# EAGLE design PSU 2x+ (EAGLE 6.3)
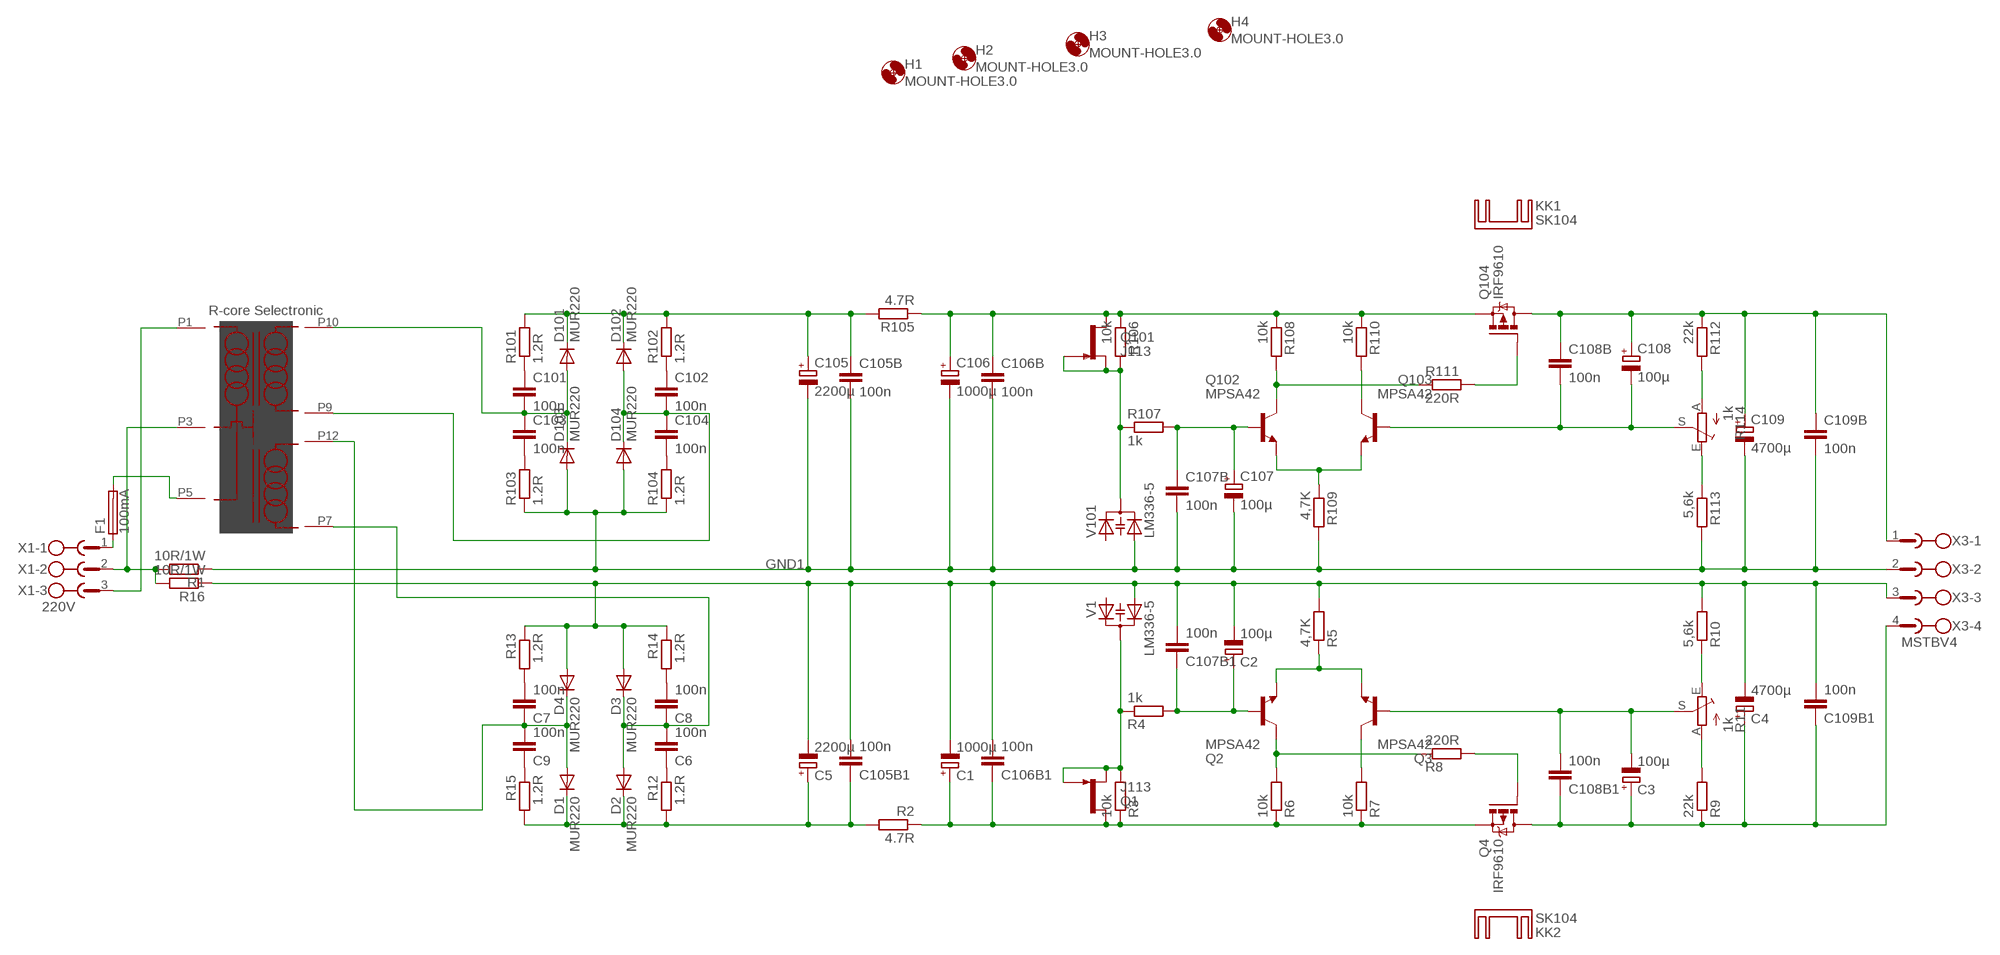
[diagram p0: schematic, sheet 1]

## Parts
C1  1000µ  CPOL-EUE7.5-16  [E7,5-16]
C2  100µ  CPOL-EUE5-10.5  [E5-10,5]
C3  100µ  CPOL-EUE5-10.5  [E5-10,5]
C4  4700µ  CPOL-EUE10-25  [EB25D]
C5  2200µ  CPOL-EUE7.5-16  [E7,5-16]
C6  100n  C-EU050-025X075  [C050-025X075]
C7  100n  C-EU050-025X075  [C050-025X075]
C8  100n  C-EU050-025X075  [C050-025X075]
C9  100n  C-EU050-025X075  [C050-025X075]
C101  100n  C-EU050-025X075  [C050-025X075]
C102  100n  C-EU050-025X075  [C050-025X075]
C103  100n  C-EU050-025X075  [C050-025X075]
C104  100n  C-EU050-025X075  [C050-025X075]
C105  2200µ  CPOL-EUE7.5-16  [E7,5-16]
C105B  100n  C-EU050-025X075  [C050-025X075]
C105B1  100n  C-EU050-025X075  [C050-025X075]
C106  1000µ  CPOL-EUE7.5-16  [E7,5-16]
C106B  100n  C-EU050-025X075  [C050-025X075]
C106B1  100n  C-EU050-025X075  [C050-025X075]
C107  100µ  CPOL-EUE5-10.5  [E5-10,5]
C107B  100n  C-EU050-025X075  [C050-025X075]
C107B1  100n  C-EU050-025X075  [C050-025X075]
C108  100µ  CPOL-EUE5-10.5  [E5-10,5]
C108B  100n  C-EU050-025X075  [C050-025X075]
C108B1  100n  C-EU050-025X075  [C050-025X075]
C109  4700µ  CPOL-EUE10-25  [EB25D]
C109B  100n  C-EU050-025X075  [C050-025X075]
C109B1  100n  C-EU050-025X075  [C050-025X075]
D1  MUR220  BY500  [DO201-15]
D2  MUR220  BY500  [DO201-15]
D3  MUR220  BY500  [DO201-15]
D4  MUR220  BY500  [DO201-15]
D101  MUR220  BY500  [DO201-15]
D102  MUR220  BY500  [DO201-15]
D103  MUR220  BY500  [DO201-15]
D104  MUR220  BY500  [DO201-15]
F1  100mA  GSH15  [GSH15]
H1  MOUNT-HOLE3.0  [3,0]
H2  MOUNT-HOLE3.0  [3,0]
H3  MOUNT-HOLE3.0  [3,0]
H4  MOUNT-HOLE3.0  [3,0]
KK1  SK104  [SK104]
KK2  SK104  [SK104]
Q1  J113  2N5458  [TO-92]
Q2  MPSA42  -NPN-TO92-EBC  [TO92-EBC]
Q3  MPSA42  -NPN-TO92-EBC  [TO92-EBC]
Q4  IRF9610  IRF9530  [TO220BV]
Q101  J113  2N5458  [TO-92]
Q102  MPSA42  -NPN-TO92-EBC  [TO92-EBC]
Q103  MPSA42  -NPN-TO92-EBC  [TO92-EBC]
Q104  IRF9610  IRF9530  [TO220BV]
R1  10R/1W  R-EU_0309/12  [0309/12]
R2  4.7R  R-EU_0207/10  [0207/10]
R3  10k  R-EU_0207/10  [0207/10]
R4  1k  R-EU_0207/10  [0207/10]
R5  4,7K  R-EU_0207/10  [0207/10]
R6  10k  R-EU_0207/10  [0207/10]
R7  10k  R-EU_0207/10  [0207/10]
R8  220R  R-EU_0207/10  [0207/10]
R9  22k  R-EU_0207/10  [0207/10]
R10  5,6k  R-EU_0207/10  [0207/10]
R11  1k  TRIM_EU-S64W  [S64W]
R12  1.2R  R-EU_0207/10  [0207/10]
R13  1.2R  R-EU_0207/10  [0207/10]
R14  1.2R  R-EU_0207/10  [0207/10]
R15  1.2R  R-EU_0207/10  [0207/10]
R16  10R/1W  R-EU_0309/12  [0309/12]
R101  1.2R  R-EU_0207/10  [0207/10]
R102  1.2R  R-EU_0207/10  [0207/10]
R103  1.2R  R-EU_0207/10  [0207/10]
R104  1.2R  R-EU_0207/10  [0207/10]
R105  4.7R  R-EU_0207/10  [0207/10]
R106  10k  R-EU_0207/10  [0207/10]
R107  1k  R-EU_0207/10  [0207/10]
R108  10k  R-EU_0207/10  [0207/10]
R109  4,7K  R-EU_0207/10  [0207/10]
R110  10k  R-EU_0207/10  [0207/10]
R111  220R  R-EU_0207/10  [0207/10]
R112  22k  R-EU_0207/10  [0207/10]
R113  5,6k  R-EU_0207/10  [0207/10]
R114  1k  TRIM_EU-S64W  [S64W]
U$1  R-CORE-SELECTRONIC-PCB  [R-CORE48MM]
V1  LM336-5  DIODE-2CAPACITANCESOT54E  [SOT54E]
V101  LM336-5  DIODE-2CAPACITANCESOT54E  [SOT54E]
X1  220V  MSTBV3  [MSTBV3]
X3  MSTBV4  [MSTBV4]

## Nets
EARTH [power]: R1.2 R16.2 U$1.P3(SHIELD3) X1.2
GND1 [power]: C105.- C105B.2 C106.- C106B.2 C107.- C107B.2 C109.- C109B.2 D103.A D104.A R1.1 R103.1 R104.1 R109.2 R113.2 V101.A2 X3.2
GND2 [power]: C1.- C2.- C4.- C5.- C105B1.2 C106B1.2 C107B1.2 C109B1.2 D3.A D4.A R5.2 R10.2 R13.1 R14.1 R16.1 V1.A2 X3.3
N$1 [power]: C101.2 C103.1 D101.A D103.C U$1.P10(SEC2-10)
N$2 [power]: C102.2 C104.1 D102.A D104.C U$1.P9(SEC2-9)
N$3: C102.1 R102.1
N$4: C103.2 R103.2
N$5 [power]: C106.+ C106B.1 Q101.1(D) Q104.S R105.1 R106.1 R108.1 R110.1
N$6: C101.1 R101.1
N$7: C104.2 R104.2
N$8 [power]: C105.+ C105B.1 D101.C D102.C R101.2 R102.2 R105.2
N$10 [power]: C6.2 C8.1 D2.A D3.C U$1.P7(SEC1-7)
N$11 [power]: C7.1 C9.2 D1.A D4.C U$1.P12(SEC1-12)
N$13 [power]: C5.+ C105B1.1 D1.C D2.C R2.2 R12.2 R15.2
N$14 [power]: C1.+ C106B1.1 Q1.1(D) Q4.S R2.1 R3.1 R6.1 R7.1
N$15: C2.+ C107B1.1 Q2.B R4.2
N$16 [power]: C3.+ C4.+ C108B1.1 C109B1.1 Q4.D R9.1 X3.4
N$18 [Mains]: F1.1 X1.1
N$19: Q2.C R6.2 R8.1
N$20: Q104.G R111.2
N$21: Q102.C R108.2 R111.1
N$22: Q3.C R7.2
N$23: C107.+ C107B.1 Q102.B R107.2
N$24: Q2.E Q3.E R5.1
N$25: Q103.C R110.2
N$26: Q102.E Q103.E R109.1
N$27: Q1.2(S) Q1.3(G) R3.2 R4.1 V1.C
N$28: Q4.G R8.2
N$29 [power]: C108.+ C108B.1 C109.+ C109B.1 Q104.D R112.1 X3.1
N$30: Q101.2(S) Q101.3(G) R106.2 R107.1 V101.C
N$31: C3.- C108B1.2 Q3.B R11.S
N$32: C108.- C108B.2 Q103.B R114.S
N$33: R9.2 R11.A
N$34: R112.2 R114.A
N$35: R113.1 R114.E
N$36: R10.1 R11.E
N$37: C6.1 R12.1
N$38 [Mains]: F1.2 U$1.P5(PRIM5)
N$39: C7.2 R13.2
N$40 [Mains]: U$1.P1(PRIM-1) X1.3
N$42: C8.2 R14.2
N$43: C9.1 R15.1
Unconnected: V1.A1 V101.A1

## Library data of the parts
C1-C5 C105-C109 = rcl:CPOL-EU: POLARIZED CAPACITOR, European symbol
C6-C9 C101-C104 C105B C105B1 C106B C106B1 C107B C107B1 C108B C108B1 C109B C109B1 = rcl:C-EU: CAPACITOR, European symbol
D1-D4 D101-D104 = diode:BY500: DIODE fast recovery diode, 5 A, 800 V
F1 = fuse:GSH15: FUSE HOLDER grid 15mm, 19649 Wickmann; MPN: 64900001039; OC_FARNELL: 1271673; OC_NEWARK: 02P0318
H1-H4 = holes:MOUNT-HOLE: MOUNTING HOLE with drill center marker
KK1 KK2 = heatsink:SK104: HEATSINK manufacturer Fischer/distributor Buerklin
Q1 Q101 = 00_steve:2N5458
Q2 Q3 Q102 Q103 = transistor:*-NPN-: NPN Transistror BF959 corrected 2008.03.06
Q4 Q104 = transistor-power:IRF9530: P-CHANNEL HEXFET POWER-MOS-FET Source: http://www.irf.com/product-info/datasheets/data/irf9530.pdf
R1-R10 R12-R16 R101-R113 = rcl:R-EU_: RESISTOR, European symbol
R11 R114 = pot:TRIM_EU-: POTENTIOMETER
U$1 = gael:R-CORE-SELECTRONIC-PCB: Transformateurs R-core pour PCB vendus par Selectronic (GAJ)
V1 V101 = diode:DIODE-2CAPACITANCE: Capacity DIODE variable-capacitance diode (Infineon)
X1 = con-phoenix-508:MSTBV3: PHOENIX; MPN: MSTBV 2,5/3-GF-5.08; OC_FARNELL: 1792793; OC_NEWARK: 69R9846
X3 = con-phoenix-508:MSTBV4: PHOENIX; MPN: MSTBV 2,5/4-GF-5.08; OC_FARNELL: 1792794; OC_NEWARK: 69R9847

## Net classes
0 default: width 0.508 mm, clearance 0.203 mm
1 Mains: width 1.016 mm, clearance 2.5 mm
2 power: width 1.016 mm, clearance 0.203 mm

## Board
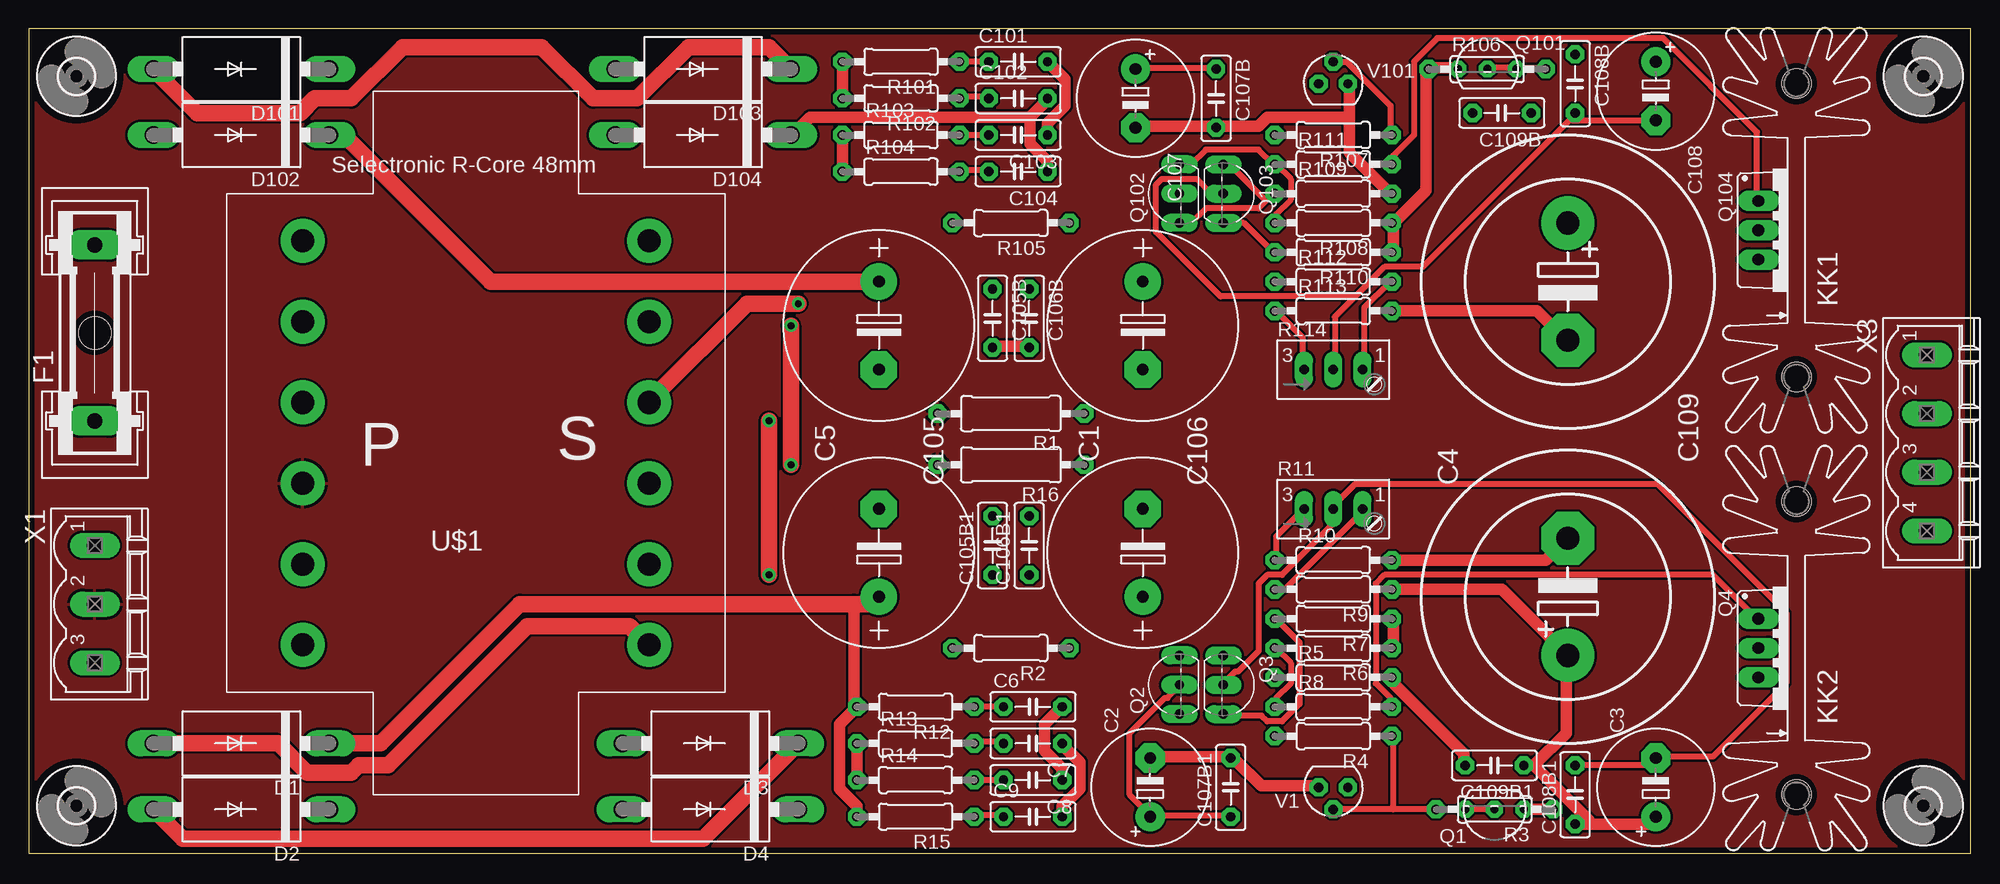
[diagram p1: board, top side]
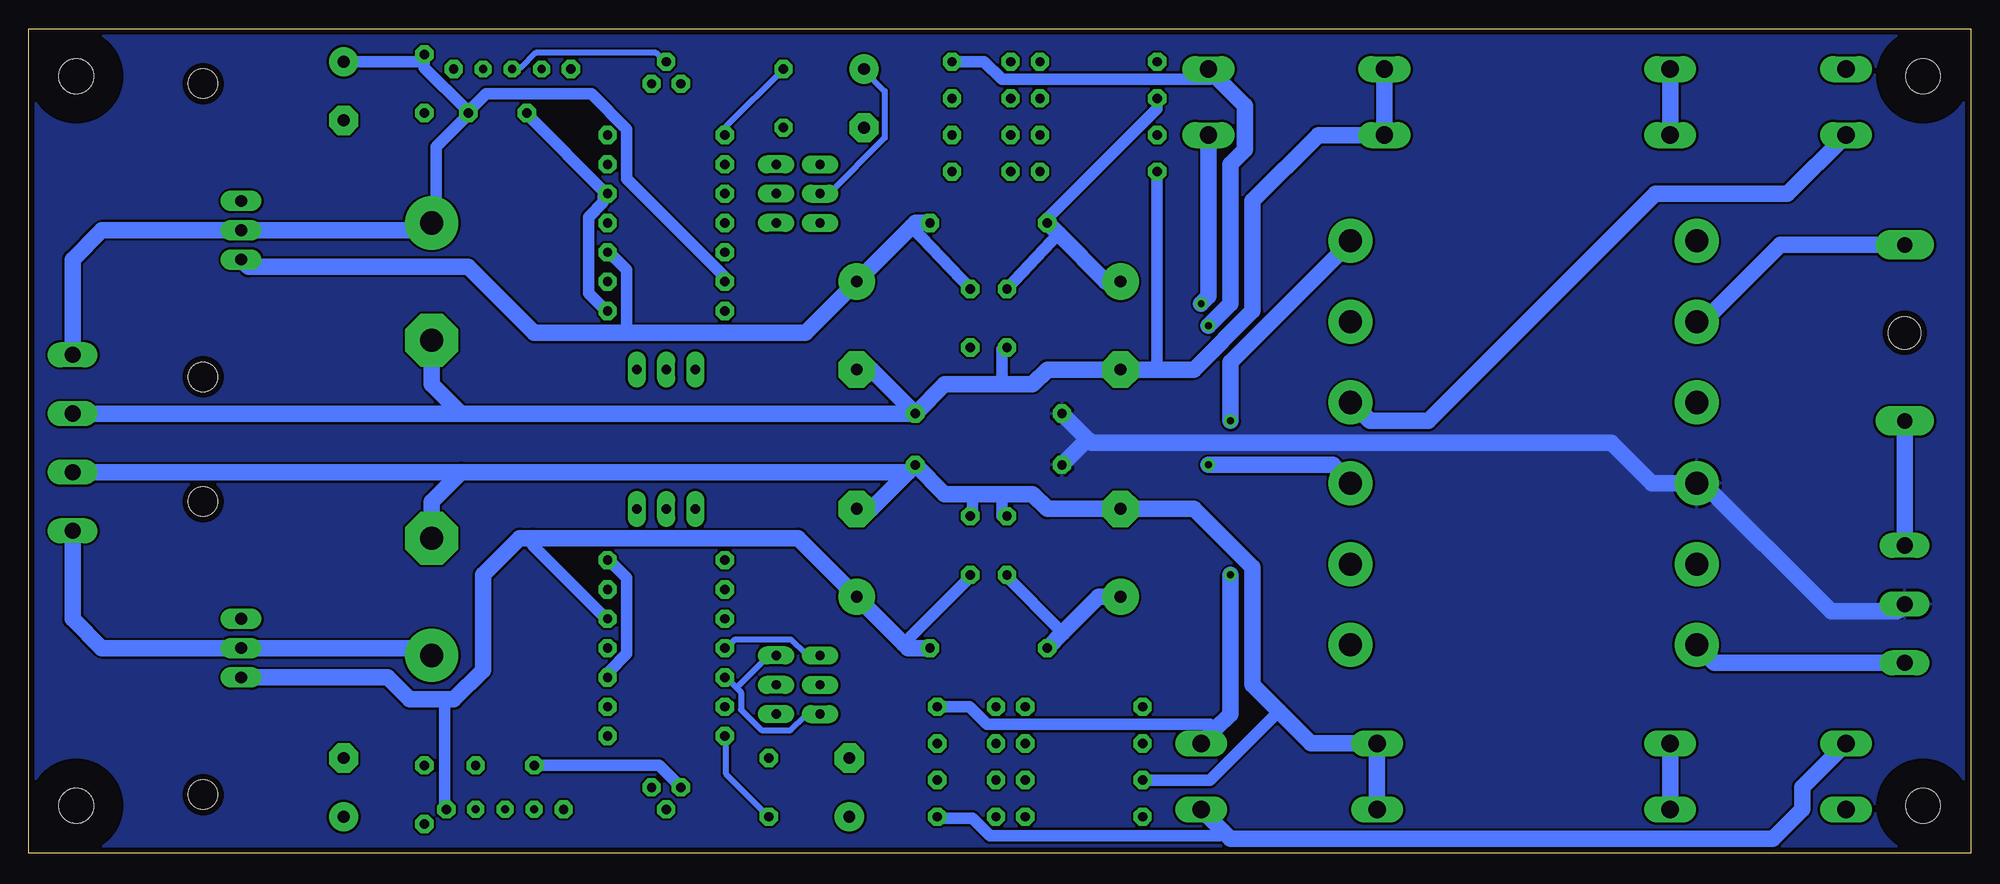
[diagram p2: board, bottom side, seen from below]

Size 168.25 x 71.42 mm. Coordinates in mm from the lower left corner, seen from the top.
Outline: 0,0 168.25,0 168.25,71.42 0,71.42 0,0
Copper layers (1*16): Top 0.035mm / dielectric 1.5mm / Bottom 0.035mm
Design rules "gael design rules": minimum track width 0.2mm, minimum drill 0.4mm, track to track 8mil, track to pad 8mil, pad to pad 8mil, via to via 8mil, smd to smd 8mil, copper to edge 20mil, drill to drill 8mil, minimum pad ring 15mil, minimum via ring 10mil, stop-mask expansion 4mil, vias tented up to drill 0mil, thermal gap 10mil

### Footprints (pad centres in the part's own frame; a part is rotated, then mirrored left to right if it is on the bottom)
E7,5-16 = drill 1.016 pad 3.15: + -3.81,0 | drill 1.016 pad 3.15 octagon: - 3.81,0
E5-10,5 = drill 1.016 pad 2.54: + -2.54,0 | drill 1.016 pad 2.54 octagon: - 2.54,0
EB25D = drill 2.007 pad 4.597: + -5.08,0 | drill 2.007 pad 4.597 octagon: - 5.08,0
C050-025X075 = drill 0.813 octagon: 1 -2.54,0; 2 2.54,0
DO201-15 = drill 1.499 long: A 7.62,0; C -7.62,0
GSH15 = drill 1.321 pad 2.54 long: 1 -7.62,0; 2 7.62,0 | hole 2.794: 0,0
3,0 = hole 3: 0,0
SK104 = hole 2.54: -12.7,-0.762; 12.7,-0.762
TO-92 = drill 0.7 octagon: 1 -2.54,0; 2 0,0; 3 2.54,0
TO92-EBC = drill 0.813 long: B 0,-1.27; C 2.54,-1.27; E -2.54,-1.27
TO220BV = drill 1.016 long: D 0,-2.54; G -2.54,-2.54; S 2.54,-2.54
0309/12 = drill 0.813 octagon: 1 -6.35,0; 2 6.35,0
0207/10 = drill 0.813 octagon: 1 -5.08,0; 2 5.08,0
S64W = drill 0.813 long: A 2.54,1.27; E -2.54,1.27; S 0,1.27
R-CORE48MM = drill 2 pad 3.81: P1 -15,-17.5; P2 -15,-10.5; P3 -15,-3.5; P4 -15,3.5; P5 -15,10.5; P6 -15,17.5; P7 15,17.5; P8 15,10.5; P9 15,3.5; P10 15,-3.5; P11 15,-10.5; P12 15,-17.5
SOT54E = drill 0.813 octagon: A1 -1.27,0; A2 1.27,0; C 0,1.905
MSTBV3 = drill 1.397 long: 1 -5.08,0; 2 0,0; 3 5.08,0
MSTBV4 = drill 1.397 long: 1 -7.62,0; 2 -2.54,0; 3 2.54,0; 4 7.62,0

### Placement (x,y rotation side)
C1  96.52,26.04 90 top
C2  97.16,5.71 90 top
C3  140.97,5.71 90 top
C4  133.35,22.23 90 top
C5  73.66,26.04 90 top
C6  86.99,12.7 0 top
C7  86.99,9.53 180 top
C8  86.99,6.35 180 top
C9  86.99,3.17 0 top
C101  85.72,68.58 0 top
C102  85.72,65.41 0 top
C103  85.72,62.23 180 top
C104  85.72,59.05 180 top
C105  73.66,45.72 270 top
C105B  83.5,46.35 270 top
C105B1  83.5,26.67 90 top
C106  96.52,45.72 270 top
C106B  86.68,46.35 270 top
C106B1  86.68,26.67 90 top
C107  95.88,65.41 270 top
C107B  102.87,65.41 270 top
C107B1  104.14,5.71 90 top
C108  140.97,66.04 270 top
C108B  133.99,66.67 270 top
C108B1  133.99,5.08 90 top
C109  133.35,49.53 270 top
C109B  127.63,64.14 180 top
C109B1  127,7.62 180 top
D1  18.41,9.53 180 top
D2  18.41,3.81 180 top
D3  59.05,9.53 180 top
D4  59.05,3.81 180 top
D101  18.41,67.94 180 top
D102  18.41,62.23 180 top
D103  58.42,67.94 180 top
D104  58.42,62.23 180 top
F1  5.72,45.09 90 top
H1  4.13,67.31 0 top
H2  4.13,4.13 0 top
H3  164.15,67.31 0 top
H4  164.15,4.13 0 top
KK1  152.4,53.98 90 top
KK2  152.4,17.78 90 top
Q1  127,3.81 180 top
Q2  98.42,14.61 90 top
Q3  104.77,14.61 270 top
Q4  152.4,17.78 270 top
Q101  126.36,67.94 0 top
Q102  98.42,57.15 90 top
Q103  104.77,57.15 270 top
Q104  152.4,53.98 270 top
R1  85.09,38.1 180 top
R2  85.09,17.78 180 top
R3  127,3.81 180 top
R4  113.03,10.16 180 top
R5  113.03,15.24 0 top
R6  113.03,17.78 180 top
R7  113.03,20.32 180 top
R8  113.03,12.7 0 top
R9  113.03,22.86 180 top
R10  113.03,25.4 0 top
R11  113.03,28.57 0 top
R12  76.83,12.7 180 top
R13  76.83,9.53 0 top
R14  76.83,6.35 0 top
R15  76.83,3.17 180 top
R16  85.09,33.66 180 top
R101  75.56,68.58 180 top
R102  75.56,65.41 180 top
R103  75.56,62.23 0 top
R104  75.56,59.05 0 top
R105  85.09,54.61 180 top
R106  126.36,67.94 0 top
R107  113.03,62.23 180 top
R108  113.03,54.61 180 top
R109  113.03,57.15 0 top
R110  113.03,52.07 180 top
R111  113.03,59.69 0 top
R112  113.03,49.53 0 top
R113  113.03,46.99 0 top
R114  113.03,40.64 0 top
U$1  38.73,35.56 0 top
V1  113.03,5.71 180 top
V101  113.03,66.67 0 top
X1  5.72,21.59 270 top
X3  164.47,35.56 270 top

### Tracks (layer width: path | path; a pad name or v marks a point on that pad's centre or on a via)
EARTH
  Bottom 1.422: X1.2 6.35,20.95 12.07,20.95 23.5,32.38 U$1.P3 27.62,32.06 31.12,35.56 76.2,35.56 76.52,35.88 | 76.52,35.88 R1.2 | R16.2 76.52,35.88
  pour Top: 0,71.44 168.28,71.44 168.28,0 0,0
  pour Bottom: 0,71.44 168.28,71.44 168.28,0 0,0
GND1
  Top 1.016: C107.- 95.88,62.99 102.74,62.99 C107B.2 103.25,62.99 106.55,62.99 107.31,63.75 114.43,63.75 | 114.43,63.75 114.43,60.71 117.98,57.15 R109.2 | 114.43,63.75 114.43,66.55 V101.A2 | R103.1 R104.1 | C105B.2 83.95,43.94 86.23,43.94 C106B.2 | R113.2 130.68,46.99 133.22,44.45 C109.-
  Bottom 1.016: C109B.2 125.09,64.01 118.24,57.15 R109.2 118.49,56.9 118.49,56.39 119.76,55.12 119.76,48.51 118.24,46.99 R113.2 | 83.95,40.64 83.95,43.69 C105B.2 | 70.48,41.91 R104.1
  Bottom 1.422: D103.A D104.A 56.52,62.23 62.23,56.52 62.23,46.99 67.31,41.91 70.48,41.91 C105.- 80.01,41.91 81.28,40.64 83.95,40.64 88.9,40.64 R1.1 | X3.2 130.81,38.1 | 130.81,38.1 R1.1 | C106.- 95.25,41.91 R1.1 | C109.- 133.35,40.64 130.81,38.1
GND2
  Top 1.016: R5.2 118.24,15.24 118.24,14.73 124.33,8.64 124.33,7.62 C109B1.2 | C2.- 97.16,8.38 104.01,8.38 C107B1.2 104.52,8.13 106.81,5.84 111.63,5.84 V1.A2 | R13.1 R14.1 | R10.2 131.44,25.4 C4.-
  Bottom 1.016: C109B1.2 113.66,7.62 V1.A2 | 83.95,31.11 83.95,29.21 C105B1.2 | 86.49,31.11 86.49,29.21 C106B1.2 | R14.1 65.91,6.35 59.94,12.32 | R5.2 117.98,15.24 117.98,15.75 116.46,17.27 116.46,23.88 117.98,25.4 R10.2
  Bottom 1.422: D4.A D3.A 57.15,9.53 59.94,12.32 62.23,14.61 62.23,24.77 67.31,29.84 C5.- 80.01,29.84 81.28,31.11 83.95,31.11 86.49,31.11 88.9,31.11 R16.1 | X3.3 130.81,33.02 | 130.81,33.02 92.07,33.02 R16.1 | C1.- 95.25,29.84 R16.1 | C4.- 133.35,30.48 130.81,33.02
N$1  (via drill 0.6)
  Top 1.016: C103.1 88.27,63.25 89.79,64.77 89.79,67.06 C101.2
  Top 1.422: D101.A 14.61,64.14 23.5,64.14 24.77,65.41 27.94,65.41 32.38,69.85 44.45,69.85 48.9,65.41 52.71,65.41 57.15,69.85 64.14,69.85 D103.C | v66.04,45.72 v66.04,33.66
  Bottom 1.016: C101.2 85.47,68.58 83.95,67.06 65.91,67.06 D103.C
  Bottom 1.422: v66.04,33.66 55.25,33.66 53.98,32.38 U$1.P10 | v66.04,45.72 64.14,47.62 64.14,59.69 62.87,60.96 62.87,64.77 D103.C
N$2  (via drill 0.6)
  Top 1.016: C104.1 88.27,59.94 86.74,61.47 86.74,63.75 | 86.74,63.75 88.27,65.28 C102.2 | 86.74,63.75 67.69,63.75 66.17,62.23 D104.C
  Top 1.422: v66.67,47.62 62.23,47.62 53.98,39.37 U$1.P9
  Bottom 1.422: U$1.P9 53.34,38.73 52.07,37.47 46.99,37.47 27.3,57.15 15.88,57.15 D102.A | v66.67,47.62 66.04,48.26 D104.C
N$3
  Top 0.508: R102.1 80.64,65.53 83.19,65.53 C102.1
N$4
  Top 0.508: C103.2 R103.2
N$5
  Top 1.016: Q101.1 123.82,68.07 121.28,68.07 R106.1 121.03,67.56 121.03,57.4 118.49,54.86 R108.1 118.24,54.61 118.24,52.07 R110.1
  Bottom 1.016: 91.76,54.29 C106B.1 | 116.46,45.09 116.46,50.55 117.98,52.07 R110.1
  Bottom 1.422: R105.1 91.44,54.61 91.76,54.29 C106.+ 100.96,45.09 116.46,45.09 124.46,45.09 130.18,50.8 149.22,50.8 Q104.S
N$6
  Top 0.508: C101.1 R101.1
N$7
  Top 0.508: R104.2 80.64,59.18 83.19,59.18 C104.2
N$8
  Top 1.016: R101.2 R102.2
  Top 1.422: D102.C 27.3,62.23 40.01,49.53 C105.+
  Bottom 1.016: 79.06,53.66 C105B.1 | R102.2 70.48,64.52 79.88,55.12 R105.2
  Bottom 1.422: D101.C D102.C | C105.+ 74.93,49.53 79.06,53.66 R105.2
N$10  (via drill 0.6)
  Top 1.016: C8.1 89.53,7.37 88.01,8.89 88.01,11.18 C6.2
  Top 1.422: D2.A 13.34,1.27 58.42,1.27 D3.C | v64.14,24.13 v64.14,37.47
  Bottom 1.016: C6.2 86.74,12.7 85.22,11.18 65.91,11.18 65.47,10.73
  Bottom 1.422: v64.14,37.47 64.14,42.55 53.98,52.7 U$1.P7 | v64.14,24.13 64.14,12.06 65.47,10.73 D3.C
N$11
  Top 1.016: C9.2 89.53,4.06 91.06,5.59 91.06,7.87 89.53,9.4 C7.1
  Top 1.422: D1.A 21.59,9.53 24.13,6.99 27.94,6.99 28.58,7.62 31.12,7.62 43.18,19.68 52.07,19.68 53.34,18.41 U$1.P12
  Bottom 1.016: C9.2 89.53,3.05 86.49,3.05 84.96,1.52 65.15,1.52 64.77,1.91
  Bottom 1.422: D4.C 64.77,1.91 64.14,1.27 17.15,1.27 14.61,3.81 14.61,5.71 D1.A
N$13
  Top 1.016: R15.2 71.75,4.06 70.23,5.59 70.23,11.18 R12.2 71.5,12.95 71.5,21.59
  Top 1.422: D1.C 30.48,9.53 42.55,21.59 71.5,21.59 73.02,21.59 C5.+
  Bottom 1.016: 78.68,19.11 83.69,24.13 C105B1.1
  Bottom 1.422: D2.C D1.C | C5.+ 75.56,22.23 78.68,19.11 R2.2
N$14
  Top 1.016: R6.1 118.24,17.78 118.24,20.32 R7.1 | R3.1 Q1.1
  Bottom 1.016: 92.46,18.16 86.49,24.13 C106B1.1 | 132.21,13.34 132.21,3.81 R3.1 | R7.1 118.24,20.32 124.59,26.67 124.59,27.3
  Bottom 1.422: R2.1 92.07,17.78 92.46,18.16 C1.+ 101.6,27.3 124.59,27.3 125.73,27.3 128.91,24.13 128.91,15.88 131.44,13.34 132.21,13.34 135.25,13.34 137.16,15.24 Q4.S
N$15
  Top 0.508: 97.16,3.3 104.01,3.3 C107B1.1 | 97.16,3.3 95.38,5.08 95.38,10.41 98.42,13.46 98.68,13.46 99.69,14.48 Q2.B | 97.16,3.3 C2.+
  Bottom 0.508: C107B1.1 107.82,6.86 107.82,10.16 R4.2
N$16
  Top 1.016: R9.1 127.63,22.86 C4.+ 133.22,16.76 133.22,10.41 130.43,7.62 | 135.25,2.54 140.34,2.54 C3.+ | 135.25,2.54 C108B1.1 | 130.43,7.62 C109B1.1 | 130.43,7.62 135.25,2.79 135.25,2.54
  Bottom 1.422: X3.4 164.47,20.32 161.92,17.78 Q4.D 133.99,17.78 C4.+
N$18
  Bottom 1.422: X1.1 F1.1
N$19
  Top 0.508: R8.1 108.08,12.7 108.08,13.46 109.35,14.73 109.35,16.51 108.08,17.78 R6.2
  Bottom 0.508: Q2.C 99.69,17.27 100.96,17.27 102.23,18.54 107.06,18.54 107.82,17.78 R6.2
N$20
  Top 0.508: R111.2 118.24,59.69 118.24,60.45 120.02,62.23 120.02,68.58 122.05,70.61 141.6,70.61 149.73,62.48 149.73,56.64 Q104.G
N$21
  Top 0.508: Q102.C 100.71,59.69 101.98,60.96 106.55,60.96 107.82,59.69 R111.1 108.08,59.69 109.35,58.42 109.35,56.64 108.08,55.37 108.08,54.61 R108.2
N$22
  Top 0.508: Q3.C 103.5,11.94 106.81,11.94 107.31,11.43 108.58,11.43 110.11,12.95 110.11,18.29 108.08,20.32 R7.2
N$23
  Top 0.508: C107B.1 102.74,68.07 95.88,68.07 C107.+
  Bottom 0.508: Q102.B 98.93,57.15 94.11,61.98 94.11,66.04 95.88,67.82 C107.+ | C107B.1 107.82,62.99 107.82,62.23 R107.2
N$24
  Bottom 0.508: 106.93,14.35 107.82,15.24 R5.1 | 106.93,14.35 106.55,13.97 106.55,12.45 104.77,10.67 102.23,10.67 100.96,11.94 99.69,11.94 Q2.E | 106.93,14.35 104.27,17.02 103.5,17.02 Q3.E
N$25
  Top 0.508: Q103.C 105.28,54.61 107.82,52.07 R110.2
N$26
  Top 0.508: Q102.E 100.71,54.61 101.98,55.88 106.55,55.88 107.19,56.52 | 107.19,56.52 107.82,57.15 R109.1 | Q103.E 104.01,59.69 107.19,56.52
N$27
  Top 0.508: Q1.2 Q1.3 R3.2 118.24,3.81 | 118.24,3.81 V1.C | 118.24,3.81 118.24,10.16 R4.1
N$28
  Top 0.508: R8.2 117.98,12.7 117.98,13.46 116.71,14.73 116.71,23.37 117.47,24.13 145.92,24.13 149.73,20.32 Q4.G
N$29
  Bottom 1.016: R112.1 108.08,49.53 108.08,50.04 116.46,58.42 116.46,62.74 119.51,65.79 128.65,65.79 130.18,64.26 C109B.1 | C109B.1 130.43,64.52 133.99,68.07 C108B.1 134.24,68.58 C108.+ | C109.+ 132.97,55.12 132.97,61.21 130.43,63.75 C109B.1
  Bottom 1.422: X3.1 164.47,51.44 161.92,53.98 Q104.D 133.99,53.98 C109.+
N$30
  Top 0.508: 128.91,68.07 126.36,68.07 Q101.2 | 128.91,68.07 131.44,68.07 R106.2 | 128.91,68.07 Q101.3 | V101.C 114.17,68.58 117.98,64.77 117.98,62.23 R107.1
  Bottom 0.508: Q101.2 126.36,68.07 125.6,68.07 124.33,69.34 113.92,69.34 113.16,68.58 V101.C
N$31
  Top 0.508: C108B1.2 140.34,7.62 C3.- 141.1,8.38 145.92,8.38 152.27,14.73 152.27,20.83 141.1,32 114.94,32 112.9,29.97 R11.S 112.9,29.72 112.9,28.45 108.58,24.13 107.31,24.13 106.55,23.37 106.55,17.53 104.77,15.75 104.52,15.75 103.5,14.73 Q3.B
N$32
  Top 0.508: 114.81,48.13 117.47,50.8 120.78,50.8 133.99,64.01 C108B.2 133.73,63.5 C108.- | 114.81,48.13 113.16,46.48 113.16,41.91 R114.S | Q103.B 102.49,57.15 101.22,58.42 98.17,58.42 97.66,57.91 97.66,53.85 103.25,48.26 114.68,48.26 114.81,48.13
N$33
  Top 0.508: R9.2 108.84,22.86 115.7,29.72 R11.A
N$34
  Top 0.508: R114.A 115.7,41.91 115.7,47.24 117.98,49.53 R112.2
N$35
  Top 0.508: R114.E 110.36,41.91 110.36,44.7 108.08,46.99 R113.1
N$36
  Top 0.508: R11.E 108.08,27.43 108.08,25.4 R10.1
N$37
  Top 0.508: C6.1 R12.1
N$38
  Bottom 1.422: F1.2 16.51,52.7 23.5,45.72 U$1.P5
N$39
  Top 0.508: R13.2 81.91,9.65 84.45,9.65 C7.2
N$40
  Bottom 1.422: X1.3 22.23,16.51 23.5,17.78 U$1.P1
N$42
  Top 0.508: C8.2 R14.2
N$43
  Top 0.508: R15.1 81.91,3.3 84.45,3.3 C9.1